# Altium schematic sheet SODIMM_6760X3000_200PIN_2V5_MO-224CA.schdoc
size A4; Organization: Organization; Address1: Address1; Address2: Address2; Address3: Address3; Address4: Address4; DocumentNumber: 1; Revision: 0; SheetNumber: 2; SheetTotal: 2
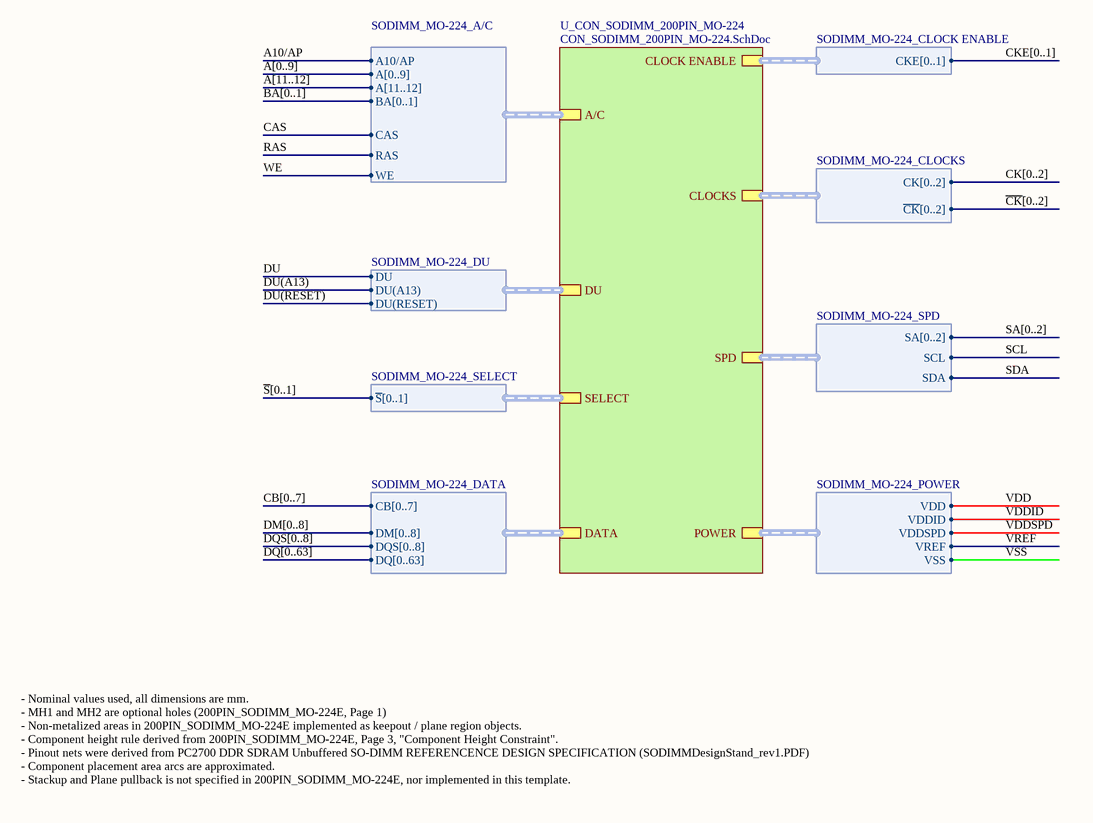
[diagram p0: SODIMM_6760X3000_200PIN_2V5_MO-224CA.schdoc]

## Sub-sheets
U_CON_SODIMM_200PIN_MO-224 = CON_SODIMM_200PIN_MO-224.SchDoc: CLOCKS (harness SODIMM_MO-224_CLOCKS), DATA (harness SODIMM_MO-224_DATA), SELECT (harness SODIMM_MO-224_SELECT), CLOCK ENABLE (harness SODIMM_MO-224_CLOCK ENABLE), A/C (harness SODIMM_MO-224_A/C), SPD (harness SODIMM_MO-224_SPD), DU (harness SODIMM_MO-224_DU), POWER (harness SODIMM_MO-224_POWER)

## Harnesses
SODIMM_MO-224_CLOCKS: CK[0..2], ~{CK}[0..2]
SODIMM_MO-224_DATA: CB[0..7], DM[0..8], DQS[0..8], DQ[0..63]
SODIMM_MO-224_SELECT: ~{S}[0..1]
SODIMM_MO-224_CLOCK ENABLE: CKE[0..1]
SODIMM_MO-224_A/C: A10/AP, A[0..9], A[11..12], BA[0..1], CAS, RAS, WE
SODIMM_MO-224_SPD: SA[0..2], SCL, SDA
SODIMM_MO-224_DU: DU, DU(A13), DU(RESET)
SODIMM_MO-224_POWER: VDD, VDDID, VDDSPD, VREF, VSS

## Nets
A10/AP: sheet U_CON_SODIMM_200PIN_MO-224/A/C.A10/AP
CAS: sheet U_CON_SODIMM_200PIN_MO-224/A/C.CAS
DU: sheet U_CON_SODIMM_200PIN_MO-224/DU.DU
DU(A13): sheet U_CON_SODIMM_200PIN_MO-224/DU.DU(A13)
DU(RESET): sheet U_CON_SODIMM_200PIN_MO-224/DU.DU(RESET)
RAS: sheet U_CON_SODIMM_200PIN_MO-224/A/C.RAS
SCL: sheet U_CON_SODIMM_200PIN_MO-224/SPD.SCL
SDA: sheet U_CON_SODIMM_200PIN_MO-224/SPD.SDA
VDD: sheet U_CON_SODIMM_200PIN_MO-224/POWER.VDD
VDDID: sheet U_CON_SODIMM_200PIN_MO-224/POWER.VDDID
VDDSPD: sheet U_CON_SODIMM_200PIN_MO-224/POWER.VDDSPD
VREF: sheet U_CON_SODIMM_200PIN_MO-224/POWER.VREF
VSS: sheet U_CON_SODIMM_200PIN_MO-224/POWER.VSS
WE: sheet U_CON_SODIMM_200PIN_MO-224/A/C.WE

## Buses and harness runs
bus A[0..9]
bus A[11..12]
bus BA[0..1]
bus CB[0..7]
bus CK[0..2]
bus CKE[0..1]
bus DM[0..8]
bus DQ[0..63]
bus DQS[0..8]
bus SA[0..2]
bus ~{CK}[0..2]
bus ~{S}[0..1]

## Notes on the sheet
- - Nominal values used, all dimensions are mm.
  - MH1 and MH2 are optional holes (200PIN_SODIMM_MO-224E, Page 1)
  - Non-metalized areas in 200PIN_SODIMM_MO-224E implemented as keepout / plane region objects.
  - Component height rule derived from 200PIN_SODIMM_MO-224E, Page 3, "Component Height Constraint".
  - Pinout nets were derived from PC2700 DDR SDRAM Unbuffered SO-DIMM REFERENCENCE DESIGN SPECIFICATION (SODIMMDesignStand_rev1.PDF)
  - Component placement area arcs are approximated.
  - Stackup and Plane pullback is not specified in 200PIN_SODIMM_MO-224E, nor implemented in this template.
- Title
- Size:
- Date:
- A4
- Number:
- Time:
- Revision:
- Sheet
- of
- File: